# Altium schematic sheet Motherboard.SchDoc
size A4
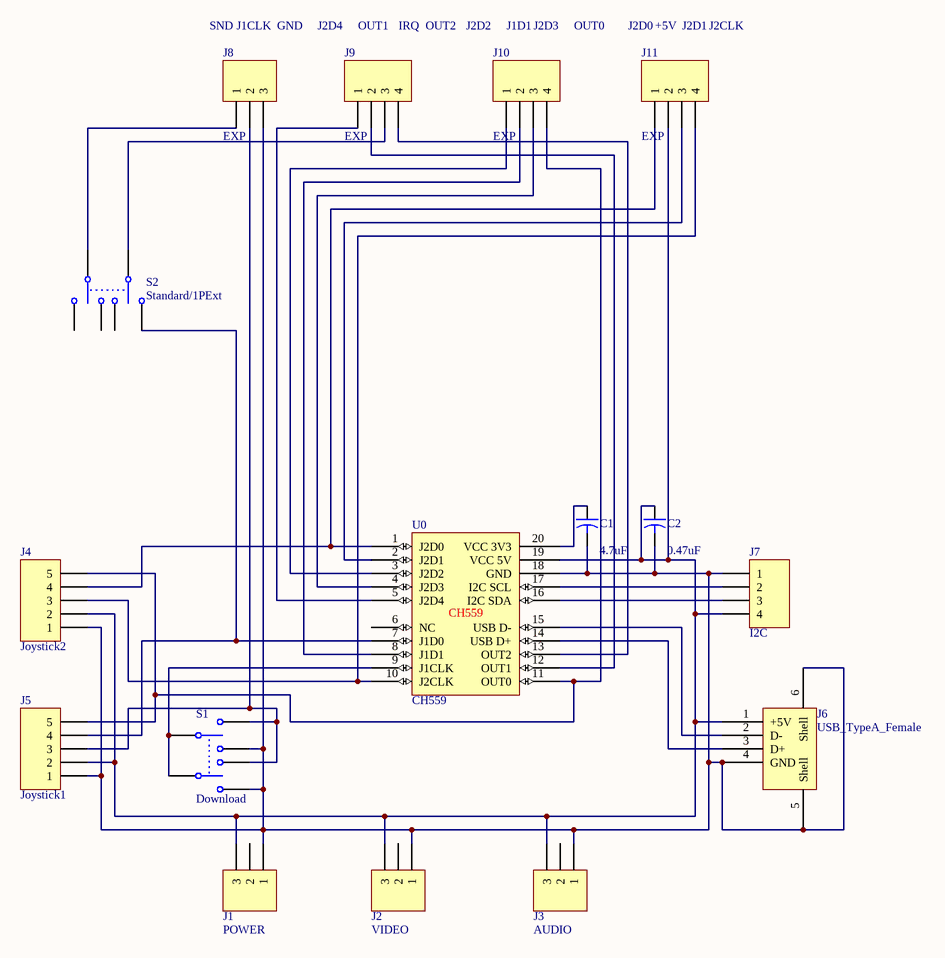
[diagram p0: Motherboard.SchDoc]

## Parts
C1  value 4.7uF  [CAPR5-4X5]  (hidden comment: Cap2)
C2  value 0.47uF  [CAPR5-4X5]  (hidden comment: Cap2)
J1  POWER  [HDR1X3H]
J2  VIDEO  [HDR1X3H]
J3  AUDIO  [HDR1X3H]
J4  Joystick2  [HDR1X5H]
J5  Joystick1  [HDR1X5H]
J6  USB_TypeA_Female  [USB_TypeA_Female]
J7  I2C  [HDR1X4H]
J8  EXP  [HDR1X3H]
J9  EXP  [HDR1X4H]
J10  EXP  [HDR1X4H]
J11  EXP  [HDR1X4H]
S1  Download  [DPDT-6]
S2  Standard/1PExt  [DPDT-6]
U0  CH559  [SSOP20]

## Nets
NetC1_1: C1.1 U0.20(VCC_3V3)
NetC1_2: C1.2 C2.2 J1.1 J2.1 J3.1 J4.1 J5.1 J6.4(GND) J6.5(Shell) J6.6(Shell) J7.1 J8.3 S1.3 S1.6 U0.18(GND)
NetC2_1: C2.1 J1.3 J2.3 J3.3 J4.2 J5.2 J6.1(+5V) J7.4 J11.2 U0.19(VCC_5V)
NetJ4_3: J4.3 J11.4 U0.10(J2CLK)
NetJ4_4: J4.4 J11.1 U0.1(J2D0)
NetJ4_5: J4.5 J5.5 J10.4 U0.11(OUT0)
NetJ5_3: J5.3 J8.2 S1.2 S1.5
NetJ5_4: J5.4 S2.2 U0.7(J1D0)
NetJ6_2: J6.2(D-) U0.15(USB_D-)
NetJ6_3: J6.3(D+) U0.14(USB_D+)
NetJ7_2: J7.2 U0.17(I2C_SCL)
NetJ7_3: J7.3 U0.16(I2C_SDA)
NetJ8_1: J8.1 S2.4
NetJ9_1: J9.1 U0.5(J2D4)
NetJ9_2: J9.2 U0.12(OUT1)
NetJ9_3: J9.3 S2.1
NetJ9_4: J9.4 U0.13(OUT2)
NetJ10_1: J10.1 U0.3(J2D2)
NetJ10_2: J10.2 U0.8(J1D1)
NetJ10_3: J10.3 U0.4(J2D3)
NetJ11_3: J11.3 U0.2(J2D1)
NetS1_1: S1.1 S1.4 U0.9(J1CLK)

Not connected (* = marked no-connect by the designer): J1 2; J2 2; J3 2; S2 3 5 6; U0 6(NC)

## Notes on the sheet
- SND
- J1CLK
- GND
- J2D4
- OUT1
- IRQ
- OUT2
- J2D2
- J1D1
- J2D3
- OUT0
- J2D0
- +5V
- J2D1
- J2CLK

## Library data of the parts
C1 C2 = Cap2: Capacitor; Published: 23-Sep-2002; PackageReference: CAPR5-4X5; Publisher: Altium Limited; PackageDescription: Capacitor; 2 Leads
J1-J3 J8 = Header 3H: Header, 3-Pin, Right Angle; LatestRevisionDate: 17-Jul-2002; LatestRevisionNote: Re-released for DXP Platform.; Publisher: Altium Limited
J4 J5 = Header 5H: Header, 5-Pin, Right Angle; LatestRevisionDate: 17-Jul-2002; LatestRevisionNote: Re-released for DXP Platform.; Publisher: Altium Limited
J7 J9-J11 = Header 4H: Header, 4-Pin, Right Angle; LatestRevisionDate: 17-Jul-2002; LatestRevisionNote: Re-released for DXP Platform.; Publisher: Altium Limited
S1 S2 = SW-DPDT: Double-Pole, Double-Throw Switch; pin to pad: 1>2 2>1 4>5 5>6 6>4; Published: 24-Mar-1999; LatestRevisionDate: 17-Jul-2002; LatestRevisionNote: Re-released for DXP Platform.; PackageReference: DPDT-6; Publisher: Altium Limited; PackageDescription: Switch; 6 Leads